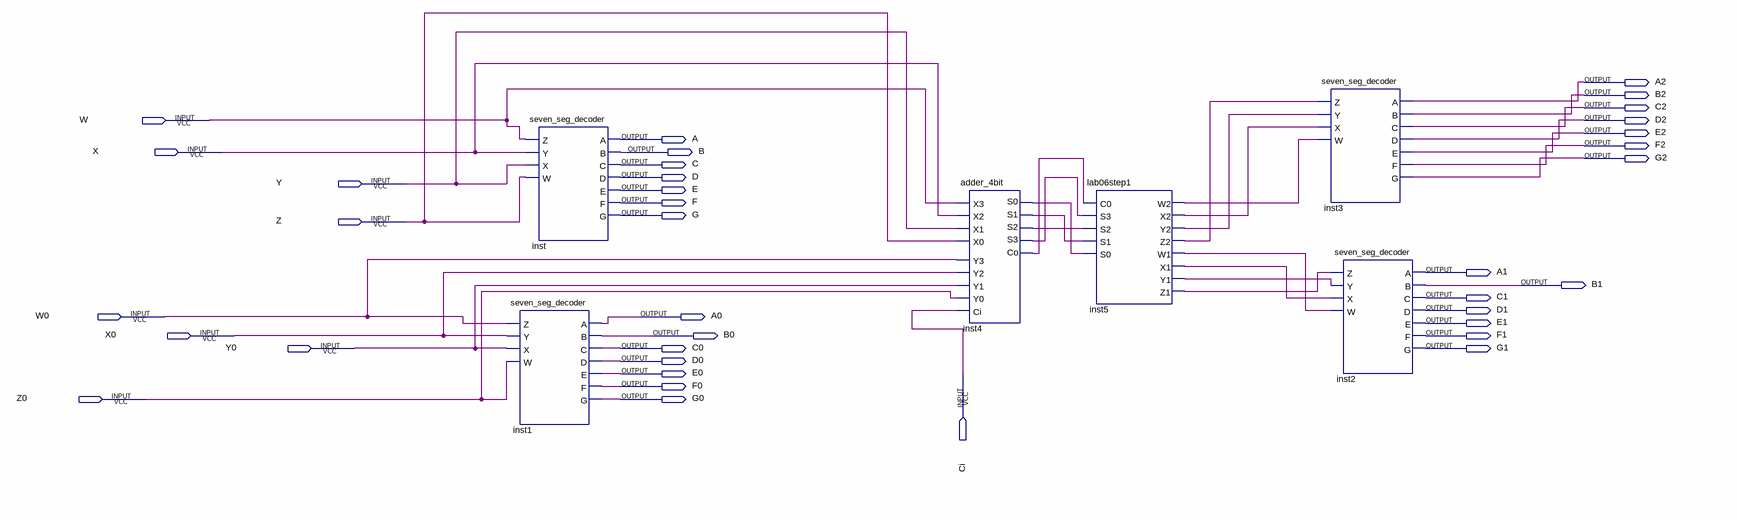
[diagram p0: schematic sheet]
// Quartus schematic Lab06.bdf as structural Verilog: 6 symbols, 37 pins
module Lab06 (
  input  W,
  input  X,
  input  Y,
  input  Z,
  input  W0,
  input  X0,
  input  Y0,
  input  Ci,
  input  Z0,
  output A2,
  output B2,
  output C2,
  output D2,
  output E2,
  output A,
  output F2,
  output B,
  output G2,
  output C,
  output D,
  output E,
  output F,
  output G,
  output A1,
  output B1,
  output C1,
  output D1,
  output A0,
  output E1,
  output B0,
  output F1,
  output C0,
  output G1,
  output D0,
  output E0,
  output F0,
  output G0
);

  wire inst4_co, inst4_s0, inst4_s1, inst4_s2, inst4_s3, inst5_w1, inst5_w2, inst5_x1, inst5_x2, inst5_y1,
       inst5_y2, inst5_z1, inst5_z2;

  seven_seg_decoder inst (.Z(W), .Y(X), .X(Y), .W(Z), .A(A), .B(B), .C(C), .D(D), .E(E), .F(F), .G(G));
  seven_seg_decoder inst1 (.Z(W0), .Y(X0), .X(Y0), .W(Z0), .A(A0), .B(B0), .C(C0), .D(D0), .E(E0), .F(F0), .G(G0));
  adder_4bit inst4 (
    .X3(W), .Y3(W0), .X2(X), .Y2(X0), .X1(Y), .Y1(Y0), .X0(Z), .Y0(Z0), .Ci(Ci), .S0(inst4_s0),
    .S1(inst4_s1), .S2(inst4_s2), .S3(inst4_s3), .Co(inst4_co));
  lab06step1 inst5 (
    .C0(inst4_co), .S3(inst4_s3), .S2(inst4_s2), .S1(inst4_s1), .S0(inst4_s0), .W2(inst5_w2), .X2(inst5_x2),
    .Y2(inst5_y2), .Z2(inst5_z2), .W1(inst5_w1), .X1(inst5_x1), .Y1(inst5_y1), .Z1(inst5_z1));
  seven_seg_decoder inst3 (
    .Z(inst5_z2), .Y(inst5_y2), .X(inst5_x2), .W(inst5_w2), .A(A2), .B(B2), .C(C2), .D(D2), .E(E2), .F(F2),
    .G(G2));
  seven_seg_decoder inst2 (
    .Z(inst5_z1), .Y(inst5_y1), .X(inst5_x1), .W(inst5_w1), .A(A1), .B(B1), .C(C1), .D(D1), .E(E1), .F(F1),
    .G(G1));
endmodule
